# Altium schematic sheet RAM_MUX4_top.SchDoc
size 381 x 241 mm; SheetNumber: 1; SheetTotal: 3
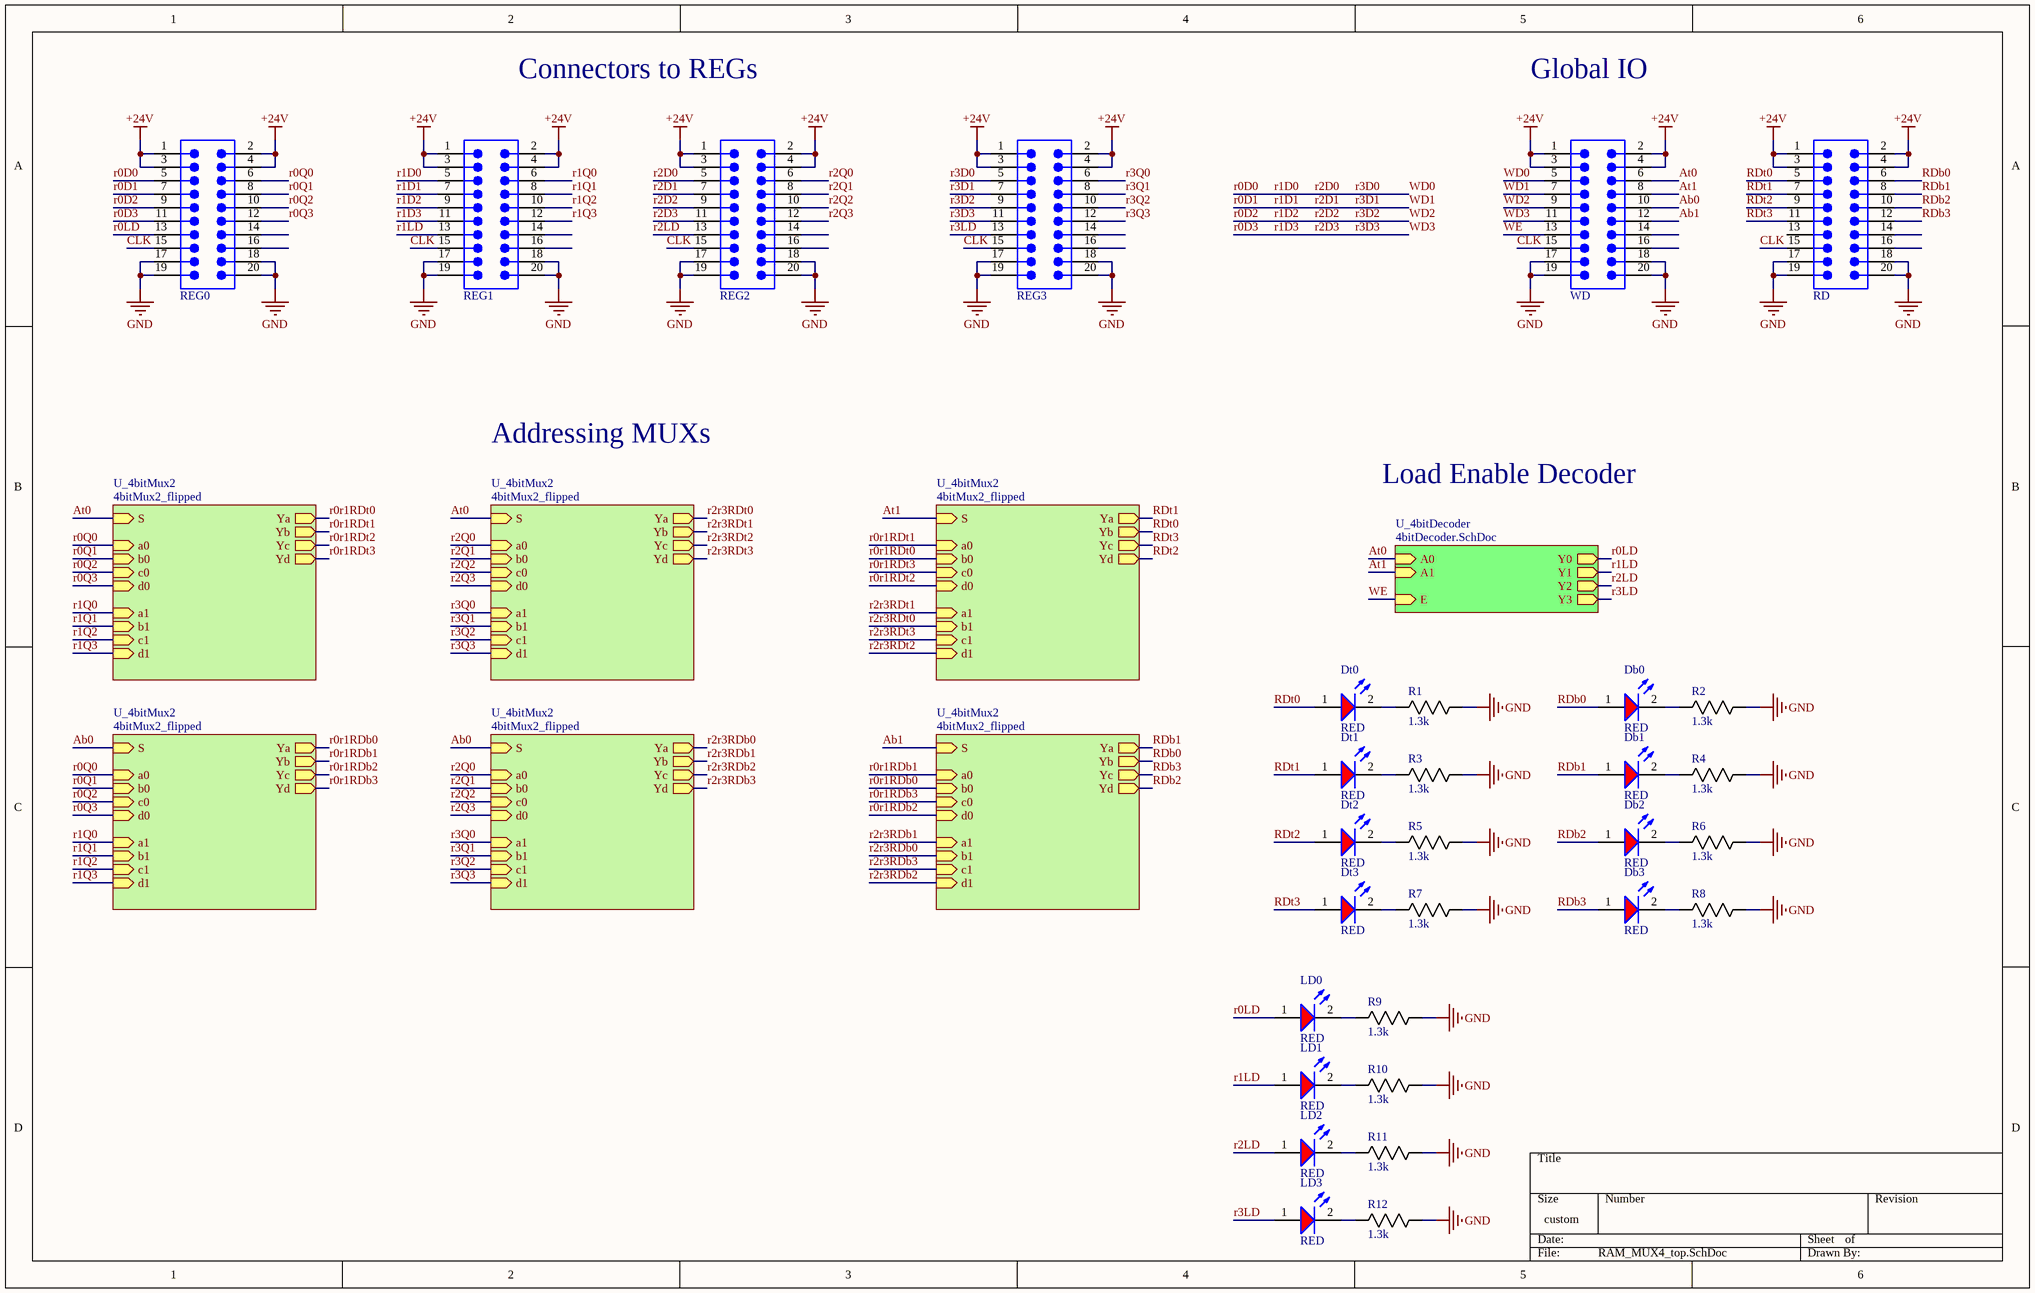
[diagram p0: RAM_MUX4_top.SchDoc]

## Parts
Db0  RED  [LED RED 151051RS11000]
Db1  RED  [LED RED 151051RS11000]
Db2  RED  [LED RED 151051RS11000]
Db3  RED  [LED RED 151051RS11000]
Dt0  RED  [LED RED 151051RS11000]
Dt1  RED  [LED RED 151051RS11000]
Dt2  RED  [LED RED 151051RS11000]
Dt3  RED  [LED RED 151051RS11000]
LD0  RED  [LED RED 151051RS11000]
LD1  RED  [LED RED 151051RS11000]
LD2  RED  [LED RED 151051RS11000]
LD3  RED  [LED RED 151051RS11000]
R1  1.3k  [RES 2512]
R2  1.3k  [RES 2512]
R3  1.3k  [RES 2512]
R4  1.3k  [RES 2512]
R5  1.3k  [RES 2512]
R6  1.3k  [RES 2512]
R7  1.3k  [RES 2512]
R8  1.3k  [RES 2512]
R9  1.3k  [RES 2512]
R10  1.3k  [RES 2512]
R11  1.3k  [RES 2512]
R12  1.3k  [RES 2512]
RD  Con 2.54mm 10x2pos  [Con 2.54mm 10x2pos]  (value not drawn)
REG0  Con 2.54mm 10x2pos  [Con 2.54mm 10x2pos]  (value not drawn)
REG1  Con 2.54mm 10x2pos  [Con 2.54mm 10x2pos]  (value not drawn)
REG2  Con 2.54mm 10x2pos  [Con 2.54mm 10x2pos]  (value not drawn)
REG3  Con 2.54mm 10x2pos  [Con 2.54mm 10x2pos]  (value not drawn)
WD  Con 2.54mm 10x2pos  [Con 2.54mm 10x2pos]  (value not drawn)

## Sub-sheets
U_4bitDecoder = 4bitDecoder.SchDoc: A1 (in), E (in), Y0 (out), Y1 (out), Y2 (out), Y3 (out), A0 (in)
U_4bitMux2 = 4bitMux2_flipped: S (in), a0 (in), a1 (in), Ya (out), b0 (in), b1 (in), Yb (out), c0 (in), c1 (in), Yc (out), d0 (in), d1 (in), Yd (out)
U_4bitMux2 = 4bitMux2_flipped: S (in), a0 (in), a1 (in), Ya (out), b0 (in), b1 (in), Yb (out), c0 (in), c1 (in), Yc (out), d0 (in), d1 (in), Yd (out)
U_4bitMux2 = 4bitMux2_flipped: S (in), a0 (in), a1 (in), Ya (out), b0 (in), b1 (in), Yb (out), c0 (in), c1 (in), Yc (out), d0 (in), d1 (in), Yd (out)
U_4bitMux2 = 4bitMux2_flipped: S (in), a0 (in), a1 (in), Ya (out), b0 (in), b1 (in), Yb (out), c0 (in), c1 (in), Yc (out), d0 (in), d1 (in), Yd (out)
U_4bitMux2 = 4bitMux2_flipped: S (in), a0 (in), a1 (in), Ya (out), b0 (in), b1 (in), Yb (out), c0 (in), c1 (in), Yc (out), d0 (in), d1 (in), Yd (out)
U_4bitMux2 = 4bitMux2_flipped: S (in), a0 (in), a1 (in), Ya (out), b0 (in), b1 (in), Yb (out), c0 (in), c1 (in), Yc (out), d0 (in), d1 (in), Yd (out)

## Nets
+24V: RD.1 RD.2 RD.3 RD.4 REG0.1 REG0.2 REG0.3 REG0.4 REG1.1 REG1.2 REG1.3 REG1.4 REG2.1 REG2.2 REG2.3 REG2.4 REG3.1 REG3.2 REG3.3 REG3.4 WD.1 WD.2 WD.3 WD.4
GND: R1.2 R2.2 R3.2 R4.2 R5.2 R6.2 R7.2 R8.2 R9.2 R10.2 R11.2 R12.2 RD.17 RD.18 RD.19 RD.20 REG0.17 REG0.18 REG0.19 REG0.20 REG1.17 REG1.18 REG1.19 REG1.20 REG2.17 REG2.18 REG2.19 REG2.20 REG3.17 REG3.18 REG3.19 REG3.20 WD.17 WD.18 WD.19 WD.20
Ab0: WD.10 ; sheet U_4bitMux2/S, sheet U_4bitMux2/S
Ab1: WD.12 ; sheet U_4bitMux2/S
At0: WD.6 ; sheet U_4bitMux2/S, sheet U_4bitMux2/S, sheet U_4bitDecoder/A0
At1: WD.8 ; sheet U_4bitMux2/S, sheet U_4bitDecoder/A1
CLK: RD.15 REG0.15 REG1.15 REG2.15 REG3.15 WD.15
r0D0: REG0.5 REG1.5 REG2.5 REG3.5 WD.5  [also labelled r1D0, r2D0, r3D0, WD0]
r0D1: REG0.7 REG1.7 REG2.7 REG3.7 WD.7  [also labelled r1D1, r2D1, r3D1, WD1]
r0D2: REG0.9 REG1.9 REG2.9 REG3.9 WD.9  [also labelled r1D2, r2D2, r3D2, WD2]
r0D3: REG0.11 REG1.11 REG2.11 REG3.11 WD.11  [also labelled r1D3, r2D3, r3D3, WD3]
r0LD: LD0.1(A) REG0.13 ; sheet U_4bitDecoder/Y0
r0Q0: REG0.6 ; sheet U_4bitMux2/a0, sheet U_4bitMux2/a0
r0Q1: REG0.8 ; sheet U_4bitMux2/b0, sheet U_4bitMux2/b0
r0Q2: REG0.10 ; sheet U_4bitMux2/c0, sheet U_4bitMux2/c0
r0Q3: REG0.12 ; sheet U_4bitMux2/d0, sheet U_4bitMux2/d0
r0r1RDb0: sheet U_4bitMux2/Ya, sheet U_4bitMux2/b0
r0r1RDb1: sheet U_4bitMux2/Yb, sheet U_4bitMux2/a0
r0r1RDb2: sheet U_4bitMux2/Yc, sheet U_4bitMux2/d0
r0r1RDb3: sheet U_4bitMux2/Yd, sheet U_4bitMux2/c0
r0r1RDt0: sheet U_4bitMux2/Ya, sheet U_4bitMux2/b0
r0r1RDt1: sheet U_4bitMux2/Yb, sheet U_4bitMux2/a0
r0r1RDt2: sheet U_4bitMux2/Yc, sheet U_4bitMux2/d0
r0r1RDt3: sheet U_4bitMux2/Yd, sheet U_4bitMux2/c0
r1LD: LD1.1(A) REG1.13 ; sheet U_4bitDecoder/Y1
r1Q0: REG1.6 ; sheet U_4bitMux2/a1, sheet U_4bitMux2/a1
r1Q1: REG1.8 ; sheet U_4bitMux2/b1, sheet U_4bitMux2/b1
r1Q2: REG1.10 ; sheet U_4bitMux2/c1, sheet U_4bitMux2/c1
r1Q3: REG1.12 ; sheet U_4bitMux2/d1, sheet U_4bitMux2/d1
r2LD: LD2.1(A) REG2.13 ; sheet U_4bitDecoder/Y2
r2Q0: REG2.6 ; sheet U_4bitMux2/a0, sheet U_4bitMux2/a0
r2Q1: REG2.8 ; sheet U_4bitMux2/b0, sheet U_4bitMux2/b0
r2Q2: REG2.10 ; sheet U_4bitMux2/c0, sheet U_4bitMux2/c0
r2Q3: REG2.12 ; sheet U_4bitMux2/d0, sheet U_4bitMux2/d0
r2r3RDb0: sheet U_4bitMux2/Ya, sheet U_4bitMux2/b1
r2r3RDb1: sheet U_4bitMux2/Yb, sheet U_4bitMux2/a1
r2r3RDb2: sheet U_4bitMux2/Yc, sheet U_4bitMux2/d1
r2r3RDb3: sheet U_4bitMux2/Yd, sheet U_4bitMux2/c1
r2r3RDt0: sheet U_4bitMux2/Ya, sheet U_4bitMux2/b1
r2r3RDt1: sheet U_4bitMux2/Yb, sheet U_4bitMux2/a1
r2r3RDt2: sheet U_4bitMux2/Yc, sheet U_4bitMux2/d1
r2r3RDt3: sheet U_4bitMux2/Yd, sheet U_4bitMux2/c1
r3LD: LD3.1(A) REG3.13 ; sheet U_4bitDecoder/Y3
r3Q0: REG3.6 ; sheet U_4bitMux2/a1, sheet U_4bitMux2/a1
r3Q1: REG3.8 ; sheet U_4bitMux2/b1, sheet U_4bitMux2/b1
r3Q2: REG3.10 ; sheet U_4bitMux2/c1, sheet U_4bitMux2/c1
r3Q3: REG3.12 ; sheet U_4bitMux2/d1, sheet U_4bitMux2/d1
RDb0: Db0.1(A) RD.6 ; sheet U_4bitMux2/Yb
RDb1: Db1.1(A) RD.8 ; sheet U_4bitMux2/Ya
RDb2: Db2.1(A) RD.10 ; sheet U_4bitMux2/Yd
RDb3: Db3.1(A) RD.12 ; sheet U_4bitMux2/Yc
RDt0: Dt0.1(A) RD.5 ; sheet U_4bitMux2/Yb
RDt1: Dt1.1(A) RD.7 ; sheet U_4bitMux2/Ya
RDt2: Dt2.1(A) RD.9 ; sheet U_4bitMux2/Yd
RDt3: Dt3.1(A) RD.11 ; sheet U_4bitMux2/Yc
WE: WD.13 ; sheet U_4bitDecoder/E
NetDb0_2: Db0.2(K) R2.1
NetDb1_2: Db1.2(K) R4.1
NetDb2_2: Db2.2(K) R6.1
NetDb3_2: Db3.2(K) R8.1
NetDt0_2: Dt0.2(K) R1.1
NetDt1_2: Dt1.2(K) R3.1
NetDt2_2: Dt2.2(K) R5.1
NetDt3_2: Dt3.2(K) R7.1
NetLD0_2: LD0.2(K) R9.1
NetLD1_2: LD1.2(K) R10.1
NetLD2_2: LD2.2(K) R11.1
NetLD3_2: LD3.2(K) R12.1

Not connected (* = marked no-connect by the designer): RD 13 14 16; REG0 14 16; REG1 14 16; REG2 14 16; REG3 14 16; WD 14 16

## Notes on the sheet
- Connectors to REGs
- Global IO
- Addressing MUXs
- Load Enable Decoder

## Library data of the parts
Db0-Db3 Dt0-Dt3 LD0-LD3 = LED RED 151051RS11000: WL-TMRC Red Color Diffused 5 mm Round Through Hole LED; Manufacturer: Wurth Elektronik; Dominant Wavelength: 645nm; Forward Current: 100mA; Forward Voltage: 2.1V; Lens Size: 5mm; Lens Style: Circular, Diffused, Round; Luminous Intensity: 30mcd; Max Reverse Voltage (DC): 5V; Peak Wavelength: 650nm; Test Current: 20mA; Viewing Angle: 60°; Wavelength: 630nm; Supplier: DigiKey; Supplier Part Number: 732-5016-ND; Manufacturer Part Number: 151051RS11000; RoHS: Compliant; Category: LEDs; Stock: 19120; Pricing: 1=0.15, 50=0.1396, 100=0.1197, 500=0.105 (USD); Case/Package: Radial; Color: Red; Height: 8.6mm; Length: 5mm; Max Operating Temperature: 85°C; Min Operating Temperature: -40°C; Mounting Technology: Through Hole; Packaging: Bulk; REACH SVHC: Unknown; Width: 5mm; ComponentLink1URL: https://datasheet.octopart.com:443/151051RS11000-Wurth-Elektronik-datasheet-168474692.pdf?src-supplier=Wurth+Elektronik; ComponentLink1Description: https://datasheet.octopart.com:443/151051RS11000-Wurth-Elektronik-datasheet-168474692.pdf?src-supplier=Wurth+Elektronik; ComponentLink2URL: https://datasheet.octopart.com:443/151051RS11000-W%C3%BCrth-Elektronik-datasheet-83005830.pdf?src-supplier=Future+Electronics; ComponentLink2Description: https://datasheet.octopart.com:443/151051RS11000-W%C3%BCrth-Elektronik-datasheet-83005830.pdf?src-supplier=Future+Electronics; ComponentLink3URL: https://datasheet.octopart.com:443/151051RS11000-W%C3%BCrth-Elektronik-datasheet-15983824.pdf?src-supplier=element14+APAC; ComponentLink3Description: https://datasheet.octopart.com:443/151051RS11000-W%C3%BCrth-Elektronik-datasheet-15983824.pdf?src-supplier=element14+APAC
R1-R12 = RES 1.3k 2512 1W: Res Thick Film 2512 1.3K Ohm 1% 1W ±100ppm/C Pad SMD Automotive T/R RMCF2512FT1K30; Manufacturer: Stackpole Electronics; Value: 1.3kΩ; Temperature Coefficient: 100ppm/°C; Voltage Rating: 500V; Working Voltage: 200V; Supplier: DigiKey; Supplier Part Number: RMCF2512FT1K30CT-ND; Manufacturer Part Number: RMCF2512FT1K30; RoHS: Compliant; Category: Chip SMD Resistors; Stock: 10417; Pricing: 1=0.24, 10=0.126, 25=0.1008, 50=0.0864, 100=0.0751, 250=0.0638, 500=0.05728, 1000=0.0521 (USD); Case/Package: 2512; China RoHS: Non-Compliant; Composition: Thick Film; Contact Plating: Tin; Depth: 3.2mm; Features: Automotive AEC-Q200; Height: 550µm; Length: 6.2992mm; Lifecycle Status: Production; Max Operating Temperature: 155°C; Max Power Dissipation: 1W; Military Standard: Not; Min Operating Temperature: -55°C; Mounting Technology: Surface Mount; Number of Terminals: 2; Number of Terminations: 2; Packaging: Tape & Reel (TR); Power Dissipation: 1W; Power Rating: 1W; Radiation Hardening: No; REACH SVHC: Yes; Schedule B: 8533210045, 8533210045|8533210045|8533210045|8533210045|8533210045; Tolerance: 1%; Width: 3.2mm; ComponentLink1URL: https://datasheet.octopart.com:443/RMCF2512FT1K30-Stackpole-Electronics-datasheet-182148065.pdf?src-supplier=IHS; ComponentLink1Description: https://datasheet.octopart.com:443/RMCF2512FT1K30-Stackpole-Electronics-datasheet-182148065.pdf?src-supplier=IHS; ComponentLink2URL: https://datasheet.octopart.com:443/RMCF2512FT1K30-Stackpole-Electronics-datasheet-28504820.pdf?src-supplier=Future+Electronics; ComponentLink2Description: https://datasheet.octopart.com:443/RMCF2512FT1K30-Stackpole-Electronics-datasheet-28504820.pdf?src-supplier=Future+Electronics; ComponentLink3URL: https://datasheet.octopart.com:443/RMCF2512FT1K30-Stackpole-Electronics-datasheet-141193804.pdf?src-supplier=Master+Electronics; ComponentLink3Description: https://datasheet.octopart.com:443/RMCF2512FT1K30-Stackpole-Electronics-datasheet-141193804.pdf?src-supplier=Master+Electronics; ComponentLink4URL: https://datasheet.octopart.com:443/RMCF2512FT1K30-Stackpole-Electronics-datasheet-189104163.pdf?src-supplier=Master+Electronics; ComponentLink4Description: https://datasheet.octopart.com:443/RMCF2512FT1K30-Stackpole-Electronics-datasheet-189104163.pdf?src-supplier=Master+Electronics; ComponentLink5URL: https://datasheet.octopart.com:443/RMCF2512FT1K30-Stackpole-Electronics-datasheet-116606903.pdf?src-supplier=Master+Electronics; ComponentLink5Description: https://datasheet.octopart.com:443/RMCF2512FT1K30-Stackpole-Electronics-datasheet-116606903.pdf?src-supplier=Master+Electronics; ComponentLink6URL: https://datasheet.octopart.com:443/RMCF2512FT1K30-Stackpole-Electronics-datasheet-62091608.pdf?src-supplier=Stackpole+Electronics; ComponentLink6Description: https://datasheet.octopart.com:443/RMCF2512FT1K30-Stackpole-Electronics-datasheet-62091608.pdf?src-supplier=Stackpole+Electronics; ComponentLink7URL: https://datasheet.octopart.com:443/RMCF2512FT1K30-Stackpole-Electronics-datasheet-12534581.pdf?src-supplier=Stackpole+Electronics; ComponentLink7Description: https://datasheet.octopart.com:443/RMCF2512FT1K30-Stackpole-Electronics-datasheet-12534581.pdf?src-supplier=Stackpole+Electronics; ComponentLink8URL: https://datasheet.octopart.com:443/RMCF2512FT1K30-Stackpole-Electronics-datasheet-10788263.pdf?src-supplier=Stackpole+Electronics; ComponentLink8Description: https://datasheet.octopart.com:443/RMCF2512FT1K30-Stackpole-Electronics-datasheet-10788263.pdf?src-supplier=Stackpole+Electronics; ComponentLink9URL: http://sigma.octopart.com:80/15940719/materials_sheet/Stackpole-Electronics-RMCF2512FT1K30.pdf?src-supplier=Compliance+Statements; ComponentLink9Description: http://sigma.octopart.com:80/15940719/materials_sheet/Stackpole-Electronics-RMCF2512FT1K30.pdf?src-supplier=Compliance+Statements; ComponentLink10URL: http://sigma.octopart.com:80/141158212/rohs_statement/Stackpole-Electronics-RMCF2512FT1K30.pdf?src-supplier=Compliance+Statements; ComponentLink10Description: http://sigma.octopart.com:80/141158212/rohs_statement/Stackpole-Electronics-RMCF2512FT1K30.pdf?src-supplier=Compliance+Statements; ComponentLink11URL: http://sigma.octopart.com:80/141158211/reach_statement/Stackpole-Electronics-RMCF2512FT1K30.pdf?src-supplier=Compliance+Statements; ComponentLink11Description: http://sigma.octopart.com:80/141158211/reach_statement/Stackpole-Electronics-RMCF2512FT1K30.pdf?src-supplier=Compliance+Statements
RD REG0-REG3 WD = Con 2.54mm 10x2pos: WR-BHD Straight Male, Box Header, Through Hole, 2 Rows, 20 Contacts, 2.54mm Pitch; Manufacturer: Wurth Elektronik; Manufacturer Part Number: 61202021621; Connector Type: Male Pin; Contact Resistance: 20mΩ; Current Rating: 3A; Insulation: Insulated; Insulation Resistance: 1GΩ; Number of Contacts: 20; Operating Supply Voltage: 250V; Supplier: DigiKey; Supplier Part Number: 732-2096-ND; RoHS: Compliant; Category: Headers and Wire Housings; Stock: 12933; Pricing: 1=0.86, 10=0.839, 50=0.7732, 160=0.69213, 320=0.64375 (USD); Color: Black; Contact Gender: Male; Contact Material: Gold; Contact Plating: Gold; Flammability Rating: UL94 V-0; Gender: Male; Height: 9.25mm; Housing Material: PBT; Insulation Material: PBT; Lead Pitch: 2.54mm; Length: 33.06mm; Max Operating Temperature: 105°C; Min Operating Temperature: -40°C; Mounting Technology: Through Hole; Pins: 20; Number of Positions: 20; Number of Rows: 2; Orientation: Vertical; Pitch: 2.54mm; Row Spacing: 2.54mm; Termination: Through Hole; Voltage Rating: 250V; Voltage Rating (DC): 250V; Width: 33.06mm; ComponentLink1URL: https://datasheet.octopart.com:443/61202021621-W%C3%BCrth-Elektronik-datasheet-111087935.pdf?src-supplier=Upverter; ComponentLink1Description: https://datasheet.octopart.com:443/61202021621-W%C3%BCrth-Elektronik-datasheet-111087935.pdf?src-supplier=Upverter; ComponentLink2URL: https://datasheet.octopart.com:443/61202021621-Wurth-Elektronik-datasheet-168480024.pdf?src-supplier=Wurth+Elektronik; ComponentLink2Description: https://datasheet.octopart.com:443/61202021621-Wurth-Elektronik-datasheet-168480024.pdf?src-supplier=Wurth+Elektronik; ComponentLink3URL: https://datasheet.octopart.com:443/61202021621-W%C3%BCrth-Elektronik-datasheet-149523954.pdf?src-supplier=Farnell; ComponentLink3Description: https://datasheet.octopart.com:443/61202021621-W%C3%BCrth-Elektronik-datasheet-149523954.pdf?src-supplier=Farnell; ComponentLink4URL: https://datasheet.octopart.com:443/61202021621-W%C3%BCrth-Elektronik-Midcom-datasheet-10469446.pdf?src-supplier=Farnell; ComponentLink4Description: https://datasheet.octopart.com:443/61202021621-W%C3%BCrth-Elektronik-Midcom-datasheet-10469446.pdf?src-supplier=Farnell; ComponentLink5URL: https://datasheet.octopart.com:443/61202021621-W%C3%BCrth-Elektronik-Midcom-datasheet-5367532.pdf?src-supplier=element14+APAC; ComponentLink5Description: https://datasheet.octopart.com:443/61202021621-W%C3%BCrth-Elektronik-Midcom-datasheet-5367532.pdf?src-supplier=element14+APAC